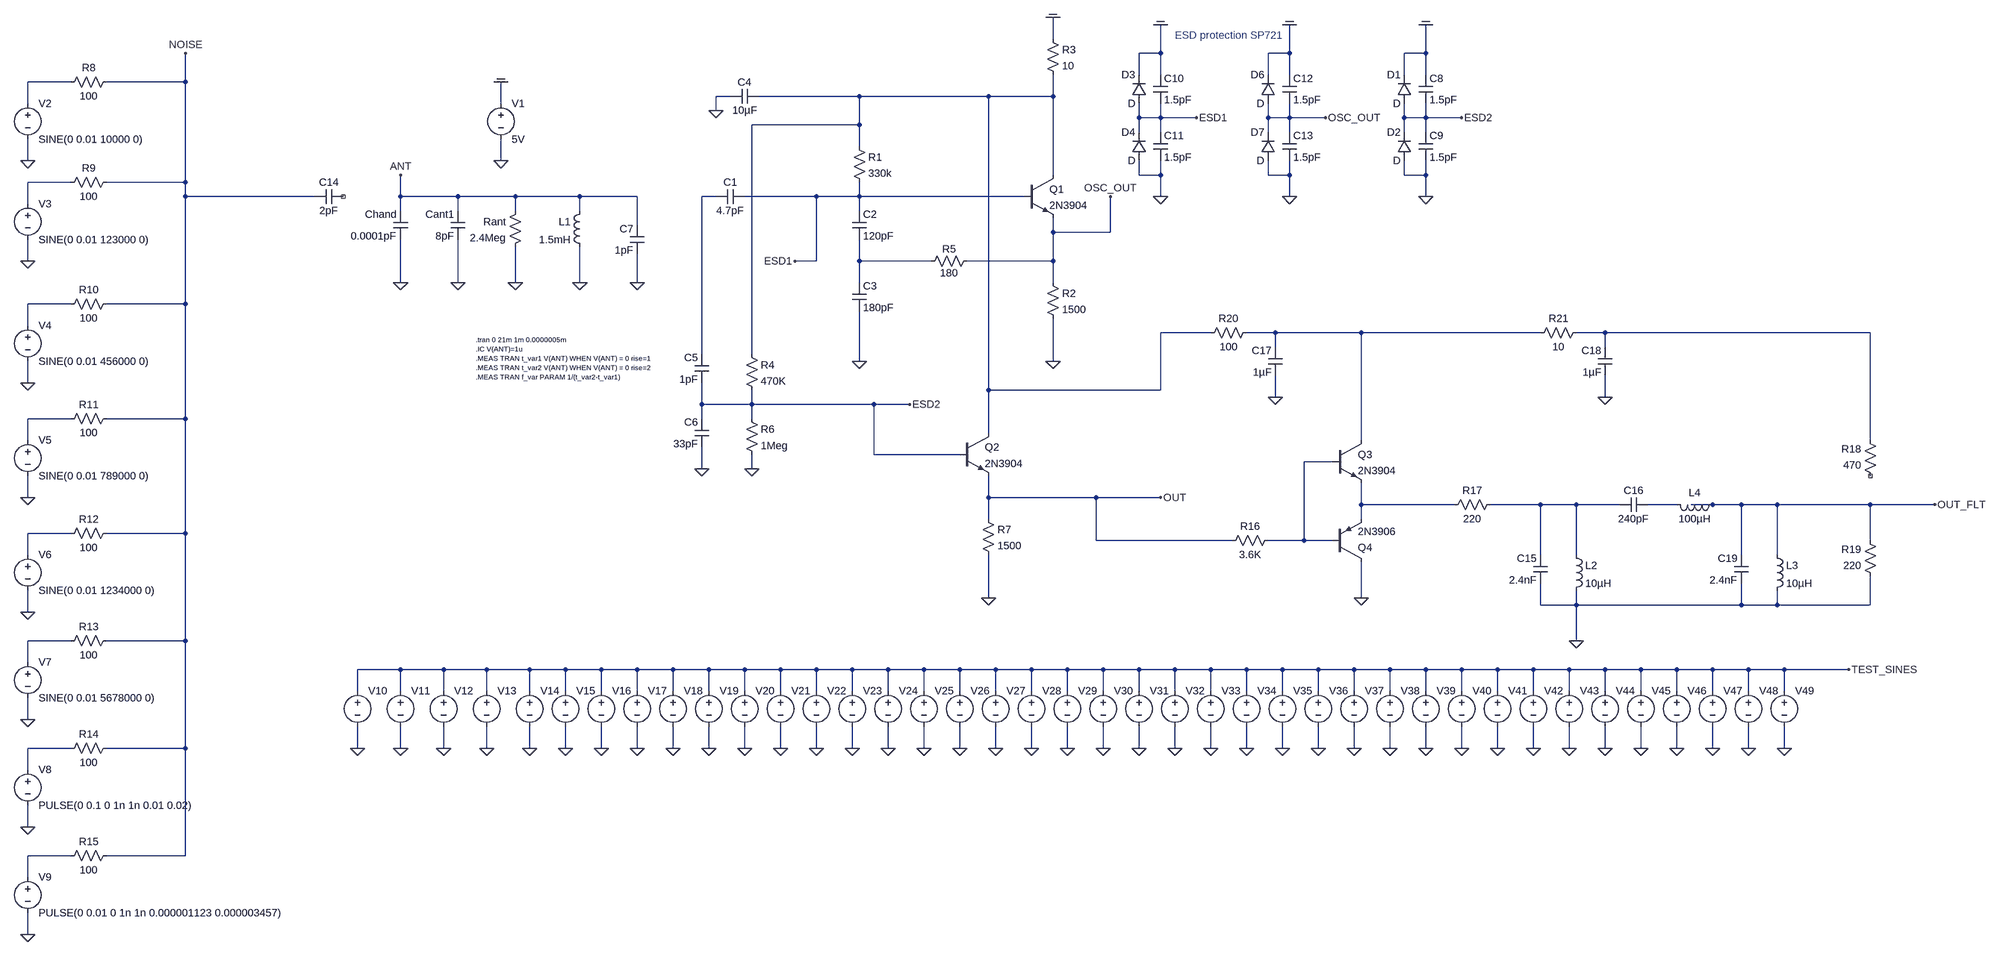
[diagram p0: schematic 2019_analog_oscill_sin_33v_noise_test_v02.asc]
2019_analog_oscill_sin_33v_noise_test_v02.asc, the LTspice schematic file:
Version 4
SHEET 1 2908 1860
WIRE 704 -160 704 -208
WIRE 944 -128 944 -192
WIRE 944 -128 896 -128
WIRE 1232 -128 1232 -192
WIRE 1232 -128 1184 -128
WIRE 1536 -128 1536 -192
WIRE 1536 -128 1488 -128
WIRE 896 -80 896 -128
WIRE 944 -80 944 -128
WIRE 1184 -80 1184 -128
WIRE 1232 -80 1232 -128
WIRE 1488 -80 1488 -128
WIRE 1536 -80 1536 -128
WIRE -1488 -64 -1584 -64
WIRE -1232 -64 -1232 -128
WIRE -1232 -64 -1408 -64
WIRE -16 -32 -48 -32
WIRE 272 -32 48 -32
WIRE 560 -32 272 -32
WIRE 704 -32 704 -80
WIRE 704 -32 560 -32
WIRE -1584 -16 -1584 -64
WIRE -528 -16 -528 -64
WIRE -48 0 -48 -32
WIRE 896 16 896 -16
WIRE 944 16 944 -16
WIRE 944 16 896 16
WIRE 1024 16 944 16
WIRE 1184 16 1184 -16
WIRE 1232 16 1232 -16
WIRE 1232 16 1184 16
WIRE 1312 16 1232 16
WIRE 1488 16 1488 -16
WIRE 1536 16 1536 -16
WIRE 1536 16 1488 16
WIRE 1616 16 1536 16
WIRE 272 32 272 -32
WIRE 272 32 32 32
WIRE 896 48 896 16
WIRE 944 48 944 16
WIRE 1184 48 1184 16
WIRE 1232 48 1232 16
WIRE 1488 48 1488 16
WIRE 1536 48 1536 16
WIRE 272 80 272 32
WIRE -1584 112 -1584 64
WIRE -528 112 -528 64
WIRE 704 144 704 -32
WIRE 896 144 896 112
WIRE 944 144 944 112
WIRE 944 144 896 144
WIRE 1184 144 1184 112
WIRE 1232 144 1232 112
WIRE 1232 144 1184 144
WIRE 1488 144 1488 112
WIRE 1536 144 1536 112
WIRE 1536 144 1488 144
WIRE -1488 160 -1584 160
WIRE -1232 160 -1232 -64
WIRE -1232 160 -1408 160
WIRE -1232 192 -1232 160
WIRE -944 192 -1232 192
WIRE -752 192 -752 144
WIRE -624 192 -752 192
WIRE -496 192 -624 192
WIRE -352 192 -496 192
WIRE -224 192 -352 192
WIRE -48 192 -80 192
WIRE 176 192 16 192
WIRE 272 192 272 160
WIRE 272 192 176 192
WIRE 640 192 272 192
WIRE 944 192 944 144
WIRE 1232 192 1232 144
WIRE 1536 192 1536 144
WIRE -1584 208 -1584 160
WIRE -752 224 -752 192
WIRE -624 224 -624 192
WIRE -496 224 -496 192
WIRE -352 224 -352 192
WIRE 272 224 272 192
WIRE -224 256 -224 192
WIRE 704 272 704 240
WIRE 832 272 832 192
WIRE 832 272 704 272
WIRE -1584 336 -1584 288
WIRE 176 336 176 192
WIRE 176 336 128 336
WIRE 272 336 272 288
WIRE 432 336 272 336
WIRE 704 336 704 272
WIRE 704 336 512 336
WIRE -752 384 -752 288
WIRE -624 384 -624 288
WIRE -496 384 -496 304
WIRE -352 384 -352 304
WIRE -224 384 -224 320
WIRE 272 384 272 336
WIRE 704 384 704 336
WIRE -1488 432 -1584 432
WIRE -1232 432 -1232 192
WIRE -1232 432 -1408 432
WIRE -1584 480 -1584 432
WIRE 1056 496 944 496
WIRE 1200 496 1136 496
WIRE 1392 496 1200 496
WIRE 1792 496 1392 496
WIRE 1936 496 1872 496
WIRE 2528 496 1936 496
WIRE 1200 528 1200 496
WIRE 1936 528 1936 496
WIRE -80 544 -80 192
WIRE 32 544 32 32
WIRE 272 560 272 448
WIRE 704 560 704 464
WIRE -1584 608 -1584 560
WIRE 560 624 560 -32
WIRE 944 624 944 496
WIRE 944 624 560 624
WIRE 1200 640 1200 592
WIRE 1936 640 1936 592
WIRE -80 656 -80 608
WIRE 32 656 32 624
WIRE 32 656 -80 656
WIRE 304 656 32 656
WIRE 384 656 304 656
WIRE -1488 688 -1584 688
WIRE -1232 688 -1232 432
WIRE -1232 688 -1408 688
WIRE -80 688 -80 656
WIRE 32 688 32 656
WIRE 560 720 560 624
WIRE -1584 736 -1584 688
WIRE 1392 736 1392 496
WIRE 2528 736 2528 496
WIRE 304 768 304 656
WIRE 496 768 304 768
WIRE 1328 784 1264 784
WIRE -80 800 -80 752
WIRE 32 800 32 768
WIRE -1584 864 -1584 816
WIRE 560 864 560 816
WIRE 800 864 560 864
WIRE 944 864 800 864
WIRE 1392 880 1392 832
WIRE 1600 880 1392 880
WIRE 1792 880 1680 880
WIRE 1872 880 1792 880
WIRE 1968 880 1872 880
WIRE 2096 880 2032 880
WIRE 2176 880 2128 880
WIRE 2240 880 2176 880
WIRE 2320 880 2240 880
WIRE 2528 880 2320 880
WIRE 2672 880 2528 880
WIRE 560 912 560 864
WIRE 1392 912 1392 880
WIRE -1488 944 -1584 944
WIRE -1232 944 -1232 688
WIRE -1232 944 -1408 944
WIRE 800 960 800 864
WIRE 1104 960 800 960
WIRE 1264 960 1264 784
WIRE 1264 960 1184 960
WIRE 1328 960 1264 960
WIRE 2528 960 2528 880
WIRE -1584 992 -1584 944
WIRE 1792 992 1792 880
WIRE 1872 992 1872 880
WIRE 2240 992 2240 880
WIRE 2320 992 2320 880
WIRE 560 1088 560 992
WIRE 1392 1088 1392 1008
WIRE 1792 1104 1792 1056
WIRE 1872 1104 1872 1072
WIRE 1872 1104 1792 1104
WIRE 2240 1104 2240 1056
WIRE 2240 1104 1872 1104
WIRE 2320 1104 2320 1072
WIRE 2320 1104 2240 1104
WIRE 2528 1104 2528 1040
WIRE 2528 1104 2320 1104
WIRE -1584 1120 -1584 1072
WIRE -1488 1184 -1584 1184
WIRE -1232 1184 -1232 944
WIRE -1232 1184 -1408 1184
WIRE 1872 1184 1872 1104
WIRE -1584 1232 -1584 1184
WIRE -752 1248 -848 1248
WIRE -656 1248 -752 1248
WIRE -560 1248 -656 1248
WIRE -464 1248 -560 1248
WIRE -384 1248 -464 1248
WIRE -304 1248 -384 1248
WIRE -224 1248 -304 1248
WIRE -144 1248 -224 1248
WIRE -64 1248 -144 1248
WIRE 16 1248 -64 1248
WIRE 96 1248 16 1248
WIRE 176 1248 96 1248
WIRE 256 1248 176 1248
WIRE 336 1248 256 1248
WIRE 416 1248 336 1248
WIRE 496 1248 416 1248
WIRE 576 1248 496 1248
WIRE 656 1248 576 1248
WIRE 736 1248 656 1248
WIRE 816 1248 736 1248
WIRE 896 1248 816 1248
WIRE 976 1248 896 1248
WIRE 1056 1248 976 1248
WIRE 1136 1248 1056 1248
WIRE 1216 1248 1136 1248
WIRE 1296 1248 1216 1248
WIRE 1376 1248 1296 1248
WIRE 1456 1248 1376 1248
WIRE 1536 1248 1456 1248
WIRE 1616 1248 1536 1248
WIRE 1696 1248 1616 1248
WIRE 1776 1248 1696 1248
WIRE 1856 1248 1776 1248
WIRE 1936 1248 1856 1248
WIRE 2016 1248 1936 1248
WIRE 2096 1248 2016 1248
WIRE 2176 1248 2096 1248
WIRE 2256 1248 2176 1248
WIRE 2336 1248 2256 1248
WIRE 2480 1248 2336 1248
WIRE -848 1296 -848 1248
WIRE -752 1296 -752 1248
WIRE -656 1296 -656 1248
WIRE -560 1296 -560 1248
WIRE -464 1296 -464 1248
WIRE -384 1296 -384 1248
WIRE -304 1296 -304 1248
WIRE -224 1296 -224 1248
WIRE -144 1296 -144 1248
WIRE -64 1296 -64 1248
WIRE 16 1296 16 1248
WIRE 96 1296 96 1248
WIRE 176 1296 176 1248
WIRE 256 1296 256 1248
WIRE 336 1296 336 1248
WIRE 416 1296 416 1248
WIRE 496 1296 496 1248
WIRE 576 1296 576 1248
WIRE 656 1296 656 1248
WIRE 736 1296 736 1248
WIRE 816 1296 816 1248
WIRE 896 1296 896 1248
WIRE 976 1296 976 1248
WIRE 1056 1296 1056 1248
WIRE 1136 1296 1136 1248
WIRE 1216 1296 1216 1248
WIRE 1296 1296 1296 1248
WIRE 1376 1296 1376 1248
WIRE 1456 1296 1456 1248
WIRE 1536 1296 1536 1248
WIRE 1616 1296 1616 1248
WIRE 1696 1296 1696 1248
WIRE 1776 1296 1776 1248
WIRE 1856 1296 1856 1248
WIRE 1936 1296 1936 1248
WIRE 2016 1296 2016 1248
WIRE 2096 1296 2096 1248
WIRE 2176 1296 2176 1248
WIRE 2256 1296 2256 1248
WIRE 2336 1296 2336 1248
WIRE -1584 1360 -1584 1312
WIRE -1488 1424 -1584 1424
WIRE -1232 1424 -1232 1184
WIRE -1232 1424 -1408 1424
WIRE -848 1424 -848 1376
WIRE -752 1424 -752 1376
WIRE -656 1424 -656 1376
WIRE -560 1424 -560 1376
WIRE -464 1424 -464 1376
WIRE -384 1424 -384 1376
WIRE -304 1424 -304 1376
WIRE -224 1424 -224 1376
WIRE -144 1424 -144 1376
WIRE -64 1424 -64 1376
WIRE 16 1424 16 1376
WIRE 96 1424 96 1376
WIRE 176 1424 176 1376
WIRE 256 1424 256 1376
WIRE 336 1424 336 1376
WIRE 416 1424 416 1376
WIRE 496 1424 496 1376
WIRE 576 1424 576 1376
WIRE 656 1424 656 1376
WIRE 736 1424 736 1376
WIRE 816 1424 816 1376
WIRE 896 1424 896 1376
WIRE 976 1424 976 1376
WIRE 1056 1424 1056 1376
WIRE 1136 1424 1136 1376
WIRE 1216 1424 1216 1376
WIRE 1296 1424 1296 1376
WIRE 1376 1424 1376 1376
WIRE 1456 1424 1456 1376
WIRE 1536 1424 1536 1376
WIRE 1616 1424 1616 1376
WIRE 1696 1424 1696 1376
WIRE 1776 1424 1776 1376
WIRE 1856 1424 1856 1376
WIRE 1936 1424 1936 1376
WIRE 2016 1424 2016 1376
WIRE 2096 1424 2096 1376
WIRE 2176 1424 2176 1376
WIRE 2256 1424 2256 1376
WIRE 2336 1424 2336 1376
WIRE -1584 1472 -1584 1424
WIRE -1584 1600 -1584 1552
WIRE -1488 1664 -1584 1664
WIRE -1232 1664 -1232 1424
WIRE -1232 1664 -1408 1664
WIRE -1584 1712 -1584 1664
WIRE -1584 1840 -1584 1792
FLAG -528 112 0
FLAG -752 384 0
FLAG -752 144 ANT
FLAG -352 384 0
FLAG 272 560 0
FLAG 704 560 0
FLAG -496 384 0
FLAG -48 0 0
FLAG 832 192 OSC_OUT
FLAG -528 -64 COM
FLAG 704 -208 COM
FLAG 944 192 0
FLAG 944 -192 COM
FLAG 1024 16 ESD1
FLAG 1232 192 0
FLAG 1232 -192 COM
FLAG 1312 16 OSC_OUT
FLAG 128 336 ESD1
FLAG 944 864 OUT
FLAG -80 800 0
FLAG 32 800 0
FLAG 560 1088 0
FLAG -224 384 0
FLAG 1536 192 0
FLAG 1536 -192 COM
FLAG 1616 16 ESD2
FLAG 384 656 ESD2
FLAG -1584 112 0
FLAG -1584 336 0
FLAG -1232 -128 NOISE
FLAG -1584 608 0
FLAG -1584 864 0
FLAG -1584 1120 0
FLAG -1584 1360 0
FLAG -1584 1600 0
FLAG -624 384 0
FLAG 1392 1088 0
FLAG 2672 880 OUT_FLT
FLAG 1872 1184 0
FLAG -1584 1840 0
FLAG 1200 640 0
FLAG 1936 640 0
FLAG -848 1424 0
FLAG -752 1424 0
FLAG -656 1424 0
FLAG -560 1424 0
FLAG -464 1424 0
FLAG -384 1424 0
FLAG -304 1424 0
FLAG -224 1424 0
FLAG -144 1424 0
FLAG -64 1424 0
FLAG 16 1424 0
FLAG 96 1424 0
FLAG 176 1424 0
FLAG 256 1424 0
FLAG 336 1424 0
FLAG 416 1424 0
FLAG 496 1424 0
FLAG 576 1424 0
FLAG 656 1424 0
FLAG 736 1424 0
FLAG 816 1424 0
FLAG 896 1424 0
FLAG 976 1424 0
FLAG 1056 1424 0
FLAG 1136 1424 0
FLAG 1216 1424 0
FLAG 1296 1424 0
FLAG 1376 1424 0
FLAG 1456 1424 0
FLAG 1536 1424 0
FLAG 1616 1424 0
FLAG 1696 1424 0
FLAG 1776 1424 0
FLAG 1856 1424 0
FLAG 1936 1424 0
FLAG 2016 1424 0
FLAG 2096 1424 0
FLAG 2176 1424 0
FLAG 2256 1424 0
FLAG 2336 1424 0
FLAG 2480 1248 TEST_SINES
SYMBOL cap 256 224 R0
SYMATTR InstName C2
SYMATTR Value 120pF
SYMBOL res 256 64 R0
SYMATTR InstName R1
SYMATTR Value 330k
SYMBOL voltage -528 -32 R0
WINDOW 123 0 0 Left 2
WINDOW 39 0 0 Left 2
SYMATTR InstName V1
SYMATTR Value 5V
SYMBOL ind -336 208 M0
SYMATTR InstName L1
SYMATTR Value 1.5mH
SYMATTR SpiceLine Ipk=0.1 Rser=120 Rpar=9Meg Cpar=1.76pF
SYMBOL cap -736 224 M0
SYMATTR InstName Chand
SYMATTR Value 0.0001pF
SYMBOL cap -48 176 M90
WINDOW 0 0 32 VBottom 2
WINDOW 3 32 32 VTop 2
SYMATTR InstName C1
SYMATTR Value 4.7pF
SYMBOL npn 640 144 R0
SYMATTR InstName Q1
SYMATTR Value 2N3904
SYMBOL cap 256 384 R0
SYMATTR InstName C3
SYMATTR Value 180pF
SYMBOL res 688 368 R0
SYMATTR InstName R2
SYMATTR Value 1500
SYMBOL res -480 208 M0
SYMATTR InstName Rant
SYMATTR Value 2.4Meg
SYMBOL cap 48 -48 R90
WINDOW 0 0 32 VBottom 2
WINDOW 3 32 32 VTop 2
SYMATTR InstName C4
SYMATTR Value 10µF
SYMBOL res 688 -176 R0
SYMATTR InstName R3
SYMATTR Value 10
SYMBOL res 528 320 R90
WINDOW 0 5 56 VBottom 2
WINDOW 3 27 56 VTop 2
SYMATTR InstName R5
SYMATTR Value 180
SYMBOL diode 912 -16 R180
WINDOW 0 24 64 Left 2
WINDOW 3 24 0 Left 2
SYMATTR InstName D3
SYMBOL diode 912 112 R180
WINDOW 0 24 64 Left 2
WINDOW 3 24 0 Left 2
SYMATTR InstName D4
SYMBOL cap 928 -80 R0
SYMATTR InstName C10
SYMATTR Value 1.5pF
SYMBOL cap 928 48 R0
SYMATTR InstName C11
SYMATTR Value 1.5pF
SYMBOL diode 1200 -16 R180
WINDOW 0 24 64 Left 2
WINDOW 3 24 0 Left 2
SYMATTR InstName D6
SYMBOL diode 1200 112 R180
WINDOW 0 24 64 Left 2
WINDOW 3 24 0 Left 2
SYMATTR InstName D7
SYMBOL cap 1216 -80 R0
SYMATTR InstName C12
SYMATTR Value 1.5pF
SYMBOL cap 1216 48 R0
SYMATTR InstName C13
SYMATTR Value 1.5pF
SYMBOL cap -64 544 M0
SYMATTR InstName C5
SYMATTR Value 1pF
SYMBOL cap -64 688 M0
SYMATTR InstName C6
SYMATTR Value 33pF
SYMBOL res 16 528 R0
SYMATTR InstName R4
SYMATTR Value 470K
SYMBOL res 16 672 R0
SYMATTR InstName R6
SYMATTR Value 1Meg
SYMBOL npn 496 720 R0
SYMATTR InstName Q2
SYMATTR Value 2N3904
SYMBOL res 544 896 R0
SYMATTR InstName R7
SYMATTR Value 1500
SYMBOL cap -208 256 M0
SYMATTR InstName C7
SYMATTR Value 1pF
SYMBOL diode 1504 -16 R180
WINDOW 0 24 64 Left 2
WINDOW 3 24 0 Left 2
SYMATTR InstName D1
SYMBOL diode 1504 112 R180
WINDOW 0 24 64 Left 2
WINDOW 3 24 0 Left 2
SYMATTR InstName D2
SYMBOL cap 1520 -80 R0
SYMATTR InstName C8
SYMATTR Value 1.5pF
SYMBOL cap 1520 48 R0
SYMATTR InstName C9
SYMATTR Value 1.5pF
SYMBOL voltage -1584 -32 R0
WINDOW 123 0 0 Left 0
WINDOW 39 0 0 Left 0
SYMATTR InstName V2
SYMATTR Value SINE(0 0.01 10000 0)
SYMBOL voltage -1584 192 R0
WINDOW 123 0 0 Left 0
WINDOW 39 0 0 Left 0
SYMATTR InstName V3
SYMATTR Value SINE(0 0.01 123000 0)
SYMBOL res -1392 -80 R90
WINDOW 0 0 56 VBottom 2
WINDOW 3 32 56 VTop 2
SYMATTR InstName R8
SYMATTR Value 100
SYMBOL res -1392 144 R90
WINDOW 0 0 56 VBottom 2
WINDOW 3 32 56 VTop 2
SYMATTR InstName R9
SYMATTR Value 100
SYMBOL cap -944 176 M90
WINDOW 0 0 32 VBottom 2
WINDOW 3 32 32 VTop 2
SYMATTR InstName C14
SYMATTR Value 2pF
SYMBOL voltage -1584 464 R0
WINDOW 123 0 0 Left 0
WINDOW 39 0 0 Left 0
SYMATTR InstName V4
SYMATTR Value SINE(0 0.01 456000 0)
SYMBOL res -1392 416 R90
WINDOW 0 0 56 VBottom 2
WINDOW 3 32 56 VTop 2
SYMATTR InstName R10
SYMATTR Value 100
SYMBOL voltage -1584 720 R0
WINDOW 123 0 0 Left 0
WINDOW 39 0 0 Left 0
SYMATTR InstName V5
SYMATTR Value SINE(0 0.01 789000 0)
SYMBOL res -1392 672 R90
WINDOW 0 0 56 VBottom 2
WINDOW 3 32 56 VTop 2
SYMATTR InstName R11
SYMATTR Value 100
SYMBOL voltage -1584 976 R0
WINDOW 123 0 0 Left 0
WINDOW 39 0 0 Left 0
SYMATTR InstName V6
SYMATTR Value SINE(0 0.01 1234000 0)
SYMBOL res -1392 928 R90
WINDOW 0 0 56 VBottom 2
WINDOW 3 32 56 VTop 2
SYMATTR InstName R12
SYMATTR Value 100
SYMBOL voltage -1584 1216 R0
WINDOW 123 0 0 Left 0
WINDOW 39 0 0 Left 0
SYMATTR InstName V7
SYMATTR Value SINE(0 0.01 5678000 0)
SYMBOL res -1392 1168 R90
WINDOW 0 0 56 VBottom 2
WINDOW 3 32 56 VTop 2
SYMATTR InstName R13
SYMATTR Value 100
SYMBOL voltage -1584 1456 R0
WINDOW 123 0 0 Left 0
WINDOW 39 0 0 Left 0
SYMATTR InstName V8
SYMATTR Value PULSE(0 0.1 0 1n 1n 0.01 0.02)
SYMBOL res -1392 1408 R90
WINDOW 0 0 56 VBottom 2
WINDOW 3 32 56 VTop 2
SYMATTR InstName R14
SYMATTR Value 100
SYMBOL cap -608 224 M0
SYMATTR InstName Cant1
SYMATTR Value 8pF
SYMBOL npn 1328 736 R0
SYMATTR InstName Q3
SYMATTR Value 2N3904
SYMBOL pnp 1328 1008 M180
SYMATTR InstName Q4
SYMATTR Value 2N3906
SYMBOL res 1200 944 R90
WINDOW 0 0 56 VBottom 2
WINDOW 3 32 56 VTop 2
SYMATTR InstName R16
SYMATTR Value 3.6K
SYMBOL cap 1808 992 M0
SYMATTR InstName C15
SYMATTR Value 2.4nF
SYMBOL cap 2032 896 M270
WINDOW 0 32 32 VTop 2
WINDOW 3 0 32 VBottom 2
SYMATTR InstName C16
SYMATTR Value 240pF
SYMBOL ind 1856 976 R0
SYMATTR InstName L2
SYMATTR Value 10µH
SYMATTR SpiceLine Rser=1
SYMBOL ind 2192 864 R90
WINDOW 0 5 56 VBottom 2
WINDOW 3 32 56 VTop 2
SYMATTR InstName L4
SYMATTR Value 100µH
SYMATTR SpiceLine Rser=10
SYMBOL res 1696 864 R90
WINDOW 0 0 56 VBottom 2
WINDOW 3 32 56 VTop 2
SYMATTR InstName R17
SYMATTR Value 220
SYMBOL res 2544 832 R180
WINDOW 0 36 76 Left 2
WINDOW 3 36 40 Left 2
SYMATTR InstName R18
SYMATTR Value 470
SYMBOL res 2544 1056 R180
WINDOW 0 36 76 Left 2
WINDOW 3 36 40 Left 2
SYMATTR InstName R19
SYMATTR Value 220
SYMBOL voltage -1584 1696 R0
WINDOW 123 0 0 Left 0
WINDOW 39 0 0 Left 0
SYMATTR InstName V9
SYMATTR Value PULSE(0 0.01 0 1n 1n 0.000001123 0.000003457)
SYMBOL res -1392 1648 R90
WINDOW 0 0 56 VBottom 2
WINDOW 3 32 56 VTop 2
SYMATTR InstName R15
SYMATTR Value 100
SYMBOL res 1152 480 R90
WINDOW 0 0 56 VBottom 2
WINDOW 3 32 56 VTop 2
SYMATTR InstName R20
SYMATTR Value 100
SYMBOL cap 1216 528 M0
SYMATTR InstName C17
SYMATTR Value 1µF
SYMBOL res 1888 480 R90
WINDOW 0 0 56 VBottom 2
WINDOW 3 32 56 VTop 2
SYMATTR InstName R21
SYMATTR Value 10
SYMBOL cap 1952 528 M0
SYMATTR InstName C18
SYMATTR Value 1µF
SYMBOL cap 2256 992 M0
SYMATTR InstName C19
SYMATTR Value 2.4nF
SYMBOL ind 2304 976 R0
SYMATTR InstName L3
SYMATTR Value 10µH
SYMATTR SpiceLine Rser=1
SYMBOL voltage -848 1280 R0
WINDOW 3 24 96 Invisible 2
WINDOW 123 0 0 Left 0
SYMATTR Value SINE(0 0.1 10000 0)
SYMATTR InstName V10
SYMATTR SpiceLine Rser=100
SYMBOL voltage -752 1280 R0
WINDOW 3 24 96 Invisible 2
WINDOW 123 0 0 Left 0
SYMATTR Value SINE(0 0.1 12725 0)
SYMATTR InstName V11
SYMATTR SpiceLine Rser=100
SYMBOL voltage -656 1280 R0
WINDOW 3 24 96 Invisible 2
WINDOW 123 0 0 Left 0
SYMATTR Value SINE(0 0.1 16192 0)
SYMATTR InstName V12
SYMATTR SpiceLine Rser=100
SYMBOL voltage -560 1280 R0
WINDOW 3 24 96 Invisible 2
WINDOW 123 0 0 Left 0
SYMATTR Value SINE(0 0.1 20604 0)
SYMATTR InstName V13
SYMATTR SpiceLine Rser=100
SYMBOL voltage -464 1280 R0
WINDOW 3 24 96 Invisible 2
WINDOW 123 0 0 Left 0
SYMATTR Value SINE(0 0.1 26218 0)
SYMATTR InstName V14
SYMATTR SpiceLine Rser=100
SYMBOL voltage -384 1280 R0
WINDOW 3 24 96 Invisible 2
WINDOW 123 0 0 Left 0
SYMATTR Value SINE(0 0.1 33362 0)
SYMATTR InstName V15
SYMATTR SpiceLine Rser=100
SYMBOL voltage -304 1280 R0
WINDOW 3 24 96 Invisible 2
WINDOW 123 0 0 Left 0
SYMATTR Value SINE(0 0.1 42453 0)
SYMATTR InstName V16
SYMATTR SpiceLine Rser=100
SYMBOL voltage -224 1280 R0
WINDOW 3 24 96 Invisible 2
WINDOW 123 0 0 Left 0
SYMATTR Value SINE(0 0.1 54020 0)
SYMATTR InstName V17
SYMATTR SpiceLine Rser=100
SYMBOL voltage -144 1280 R0
WINDOW 3 24 96 Invisible 2
WINDOW 123 0 0 Left 0
SYMATTR Value SINE(0 0.1 68740 0)
SYMATTR InstName V18
SYMATTR SpiceLine Rser=100
SYMBOL voltage -64 1280 R0
WINDOW 3 24 96 Invisible 2
WINDOW 123 0 0 Left 0
SYMATTR Value SINE(0 0.1 87470 0)
SYMATTR InstName V19
SYMATTR SpiceLine Rser=100
SYMBOL voltage 16 1280 R0
WINDOW 3 24 96 Invisible 2
WINDOW 123 0 0 Left 0
SYMATTR Value SINE(0 0.1 111303 0)
SYMATTR InstName V20
SYMATTR SpiceLine Rser=100
SYMBOL voltage 96 1280 R0
WINDOW 3 24 96 Invisible 2
WINDOW 123 0 0 Left 0
SYMATTR Value SINE(0 0.1 141631 0)
SYMATTR InstName V21
SYMATTR SpiceLine Rser=100
SYMBOL voltage 176 1280 R0
WINDOW 3 24 96 Invisible 2
WINDOW 123 0 0 Left 0
SYMATTR Value SINE(0 0.1 180223 0)
SYMATTR InstName V22
SYMATTR SpiceLine Rser=100
SYMBOL voltage 256 1280 R0
WINDOW 3 24 96 Invisible 2
WINDOW 123 0 0 Left 0
SYMATTR Value SINE(0 0.1 229330 0)
SYMATTR InstName V23
SYMATTR SpiceLine Rser=100
SYMBOL voltage 336 1280 R0
WINDOW 3 24 96 Invisible 2
WINDOW 123 0 0 Left 0
SYMATTR Value SINE(0 0.1 291818 0)
SYMATTR InstName V24
SYMATTR SpiceLine Rser=100
SYMBOL voltage 416 1280 R0
WINDOW 3 24 96 Invisible 2
WINDOW 123 0 0 Left 0
SYMATTR Value SINE(0 0.1 371332 0)
SYMATTR InstName V25
SYMATTR SpiceLine Rser=100
SYMBOL voltage 496 1280 R0
WINDOW 3 24 96 Invisible 2
WINDOW 123 0 0 Left 0
SYMATTR Value SINE(0 0.1 472512 0)
SYMATTR InstName V26
SYMATTR SpiceLine Rser=100
SYMBOL voltage 576 1280 R0
WINDOW 3 24 96 Invisible 2
WINDOW 123 0 0 Left 0
SYMATTR Value SINE(0 0.1 601262 0)
SYMATTR InstName V27
SYMATTR SpiceLine Rser=100
SYMBOL voltage 656 1280 R0
WINDOW 3 24 96 Invisible 2
WINDOW 123 0 0 Left 0
SYMATTR Value SINE(0 0.1 765094 0)
SYMATTR InstName V28
SYMATTR SpiceLine Rser=100
SYMBOL voltage 736 1280 R0
WINDOW 3 24 96 Invisible 2
WINDOW 123 0 0 Left 0
SYMATTR Value SINE(0 0.1 973566 0)
SYMATTR InstName V29
SYMATTR SpiceLine Rser=100
SYMBOL voltage 816 1280 R0
WINDOW 3 24 96 Invisible 2
WINDOW 123 0 0 Left 0
SYMATTR Value SINE(0 0.1 1238843 0)
SYMATTR InstName V30
SYMATTR SpiceLine Rser=100
SYMBOL voltage 896 1280 R0
WINDOW 3 24 96 Invisible 2
WINDOW 123 0 0 Left 0
SYMATTR Value SINE(0 0.1 1576403 0)
SYMATTR InstName V31
SYMATTR SpiceLine Rser=100
SYMBOL voltage 976 1280 R0
WINDOW 3 24 96 Invisible 2
WINDOW 123 0 0 Left 0
SYMATTR Value SINE(0 0.1 2005940 0)
SYMATTR InstName V32
SYMATTR SpiceLine Rser=100
SYMBOL voltage 1056 1280 R0
WINDOW 3 24 96 Invisible 2
WINDOW 123 0 0 Left 0
SYMATTR Value SINE(0 0.1 2552518 0)
SYMATTR InstName V33
SYMATTR SpiceLine Rser=100
SYMBOL voltage 1136 1280 R0
WINDOW 3 24 96 Invisible 2
WINDOW 123 0 0 Left 0
SYMATTR Value SINE(0 0.1 3248027 0)
SYMATTR InstName V34
SYMATTR SpiceLine Rser=100
SYMBOL voltage 1216 1280 R0
WINDOW 3 24 96 Invisible 2
WINDOW 123 0 0 Left 0
SYMATTR Value SINE(0 0.1 4133048 0)
SYMATTR InstName V35
SYMATTR SpiceLine Rser=100
SYMBOL voltage 1296 1280 R0
WINDOW 3 24 96 Invisible 2
WINDOW 123 0 0 Left 0
SYMATTR Value SINE(0 0.1 5259219 0)
SYMATTR InstName V36
SYMATTR SpiceLine Rser=100
SYMBOL voltage 1376 1280 R0
WINDOW 3 24 96 Invisible 2
WINDOW 123 0 0 Left 0
SYMATTR Value SINE(0 0.1 6692248 0)
SYMATTR InstName V37
SYMATTR SpiceLine Rser=100
SYMBOL voltage 1456 1280 R0
WINDOW 3 24 96 Invisible 2
WINDOW 123 0 0 Left 0
SYMATTR Value SINE(0 0.1 8515749 0)
SYMATTR InstName V38
SYMATTR SpiceLine Rser=100
SYMBOL voltage 1536 1280 R0
WINDOW 3 24 96 Invisible 2
WINDOW 123 0 0 Left 0
SYMATTR Value SINE(0 0.1 10836117 0)
SYMATTR InstName V39
SYMATTR SpiceLine Rser=100
SYMBOL voltage 1616 1280 R0
WINDOW 3 24 96 Invisible 2
WINDOW 123 0 0 Left 0
SYMATTR Value SINE(0 0.1 13788737 0)
SYMATTR InstName V40
SYMATTR SpiceLine Rser=100
SYMBOL voltage 1696 1280 R0
WINDOW 3 24 96 Invisible 2
WINDOW 123 0 0 Left 0
SYMATTR Value SINE(0 0.1 17545886 0)
SYMATTR InstName V41
SYMATTR SpiceLine Rser=100
SYMBOL voltage 1776 1280 R0
WINDOW 3 24 96 Invisible 2
WINDOW 123 0 0 Left 0
SYMATTR Value SINE(0 0.1 22326781 0)
SYMATTR InstName V42
SYMATTR SpiceLine Rser=100
SYMBOL voltage 1856 1280 R0
WINDOW 3 24 96 Invisible 2
WINDOW 123 0 0 Left 0
SYMATTR Value SINE(0 0.1 28410373 0)
SYMATTR InstName V43
SYMATTR SpiceLine Rser=100
SYMBOL voltage 1936 1280 R0
WINDOW 3 24 96 Invisible 2
WINDOW 123 0 0 Left 0
SYMATTR Value SINE(0 0.1 36151619 0)
SYMATTR InstName V44
SYMATTR SpiceLine Rser=100
SYMBOL voltage 2016 1280 R0
WINDOW 3 24 96 Invisible 2
WINDOW 123 0 0 Left 0
SYMATTR Value SINE(0 0.1 46002197 0)
SYMATTR InstName V45
SYMATTR SpiceLine Rser=100
SYMBOL voltage 2096 1280 R0
WINDOW 3 24 96 Invisible 2
WINDOW 123 0 0 Left 0
SYMATTR Value SINE(0 0.1 58536855 0)
SYMATTR InstName V46
SYMATTR SpiceLine Rser=100
SYMBOL voltage 2176 1280 R0
WINDOW 3 24 96 Invisible 2
WINDOW 123 0 0 Left 0
SYMATTR Value SINE(0 0.1 74486952 0)
SYMATTR InstName V47
SYMATTR SpiceLine Rser=100
SYMBOL voltage 2256 1280 R0
WINDOW 3 24 96 Invisible 2
WINDOW 123 0 0 Left 0
SYMATTR Value SINE(0 0.1 94783124 0)
SYMATTR InstName V48
SYMATTR SpiceLine Rser=100
SYMBOL voltage 2336 1280 R0
WINDOW 3 24 96 Invisible 2
WINDOW 123 0 0 Left 0
SYMATTR Value SINE(0 0.1 120609589 0)
SYMATTR InstName V49
SYMATTR SpiceLine Rser=100
TEXT -584 512 Left 1 !.tran 0 21m 1m 0.0000005m\n.IC V(ANT)=1u\n.MEAS TRAN t_var1 V(ANT) WHEN V(ANT) = 0 rise=1\n.MEAS TRAN t_var2 V(ANT) WHEN V(ANT) = 0 rise=2\n.MEAS TRAN f_var PARAM 1/(t_var2-t_var1)
TEXT 976 -168 Left 2 ;ESD protection SP721

The netlist it stands for:
* 2019_analog_oscill_sin_33v_noise_test_v02.asc
C2 ESD1 N005 120pF
R1 N002 ESD1 330k
V1 COM 0 5V
L1 ANT 0 1.5mH Ipk=0.1 Rser=120 Rpar=9Meg Cpar=1.76pF
Chand ANT 0 0.0001pF
C1 N004 ESD1 4.7pF
Q1 N002 ESD1 OSC_OUT 0 2N3904
C3 N005 0 180pF
R2 OSC_OUT 0 1500
Rant ANT 0 2.4Meg
C4 N002 0 10µF
R3 COM N002 10
R5 OSC_OUT N005 180
D3 ESD1 COM D
D4 0 ESD1 D
C10 COM ESD1 1.5pF
C11 ESD1 0 1.5pF
D6 OSC_OUT COM D
D7 0 OSC_OUT D
C12 COM OSC_OUT 1.5pF
C13 OSC_OUT 0 1.5pF
C5 N004 ESD2 1pF
C6 ESD2 0 33pF
R4 N002 ESD2 470K
R6 ESD2 0 1Meg
Q2 N002 ESD2 OUT 0 2N3904
R7 OUT 0 1500
C7 ANT 0 1pF
D1 ESD2 COM D
D2 0 ESD2 D
C8 COM ESD2 1.5pF
C9 ESD2 0 1.5pF
V2 N001 0 SINE(0 0.01 10000 0)
V3 N003 0 SINE(0 0.01 123000 0)
R8 NOISE N001 100
R9 NOISE N003 100
C14 NOISE NC_01 2pF
V4 N006 0 SINE(0 0.01 456000 0)
R10 NOISE N006 100
V5 N009 0 SINE(0 0.01 789000 0)
R11 NOISE N009 100
V6 N014 0 SINE(0 0.01 1234000 0)
R12 NOISE N014 100
V7 N015 0 SINE(0 0.01 5678000 0)
R13 NOISE N015 100
V8 N016 0 PULSE(0 0.1 0 1n 1n 0.01 0.02)
R14 NOISE N016 100
Cant1 ANT 0 8pF
Q3 N007 N010 N011 0 2N3904
Q4 0 N010 N011 0 2N3906
R16 N010 OUT 3.6K
C15 N012 0 2.4nF
C16 N013 N012 240pF
L2 N012 0 10µH Rser=1
L4 OUT_FLT N013 100µH Rser=10
R17 N012 N011 220
R18 NC_02 N008 470
R19 0 OUT_FLT 220
V9 N017 0 PULSE(0 0.01 0 1n 1n 0.000001123 0.000003457)
R15 NOISE N017 100
R20 N007 N002 100
C17 N007 0 1µF
R21 N008 N007 10
C18 N008 0 1µF
C19 OUT_FLT 0 2.4nF
L3 OUT_FLT 0 10µH Rser=1
V10 TEST_SINES 0 SINE(0 0.1 10000 0) Rser=100
V11 TEST_SINES 0 SINE(0 0.1 12725 0) Rser=100
V12 TEST_SINES 0 SINE(0 0.1 16192 0) Rser=100
V13 TEST_SINES 0 SINE(0 0.1 20604 0) Rser=100
V14 TEST_SINES 0 SINE(0 0.1 26218 0) Rser=100
V15 TEST_SINES 0 SINE(0 0.1 33362 0) Rser=100
V16 TEST_SINES 0 SINE(0 0.1 42453 0) Rser=100
V17 TEST_SINES 0 SINE(0 0.1 54020 0) Rser=100
V18 TEST_SINES 0 SINE(0 0.1 68740 0) Rser=100
V19 TEST_SINES 0 SINE(0 0.1 87470 0) Rser=100
V20 TEST_SINES 0 SINE(0 0.1 111303 0) Rser=100
V21 TEST_SINES 0 SINE(0 0.1 141631 0) Rser=100
V22 TEST_SINES 0 SINE(0 0.1 180223 0) Rser=100
V23 TEST_SINES 0 SINE(0 0.1 229330 0) Rser=100
V24 TEST_SINES 0 SINE(0 0.1 291818 0) Rser=100
V25 TEST_SINES 0 SINE(0 0.1 371332 0) Rser=100
V26 TEST_SINES 0 SINE(0 0.1 472512 0) Rser=100
V27 TEST_SINES 0 SINE(0 0.1 601262 0) Rser=100
V28 TEST_SINES 0 SINE(0 0.1 765094 0) Rser=100
V29 TEST_SINES 0 SINE(0 0.1 973566 0) Rser=100
V30 TEST_SINES 0 SINE(0 0.1 1238843 0) Rser=100
V31 TEST_SINES 0 SINE(0 0.1 1576403 0) Rser=100
V32 TEST_SINES 0 SINE(0 0.1 2005940 0) Rser=100
V33 TEST_SINES 0 SINE(0 0.1 2552518 0) Rser=100
V34 TEST_SINES 0 SINE(0 0.1 3248027 0) Rser=100
V35 TEST_SINES 0 SINE(0 0.1 4133048 0) Rser=100
V36 TEST_SINES 0 SINE(0 0.1 5259219 0) Rser=100
V37 TEST_SINES 0 SINE(0 0.1 6692248 0) Rser=100
V38 TEST_SINES 0 SINE(0 0.1 8515749 0) Rser=100
V39 TEST_SINES 0 SINE(0 0.1 10836117 0) Rser=100
V40 TEST_SINES 0 SINE(0 0.1 13788737 0) Rser=100
V41 TEST_SINES 0 SINE(0 0.1 17545886 0) Rser=100
V42 TEST_SINES 0 SINE(0 0.1 22326781 0) Rser=100
V43 TEST_SINES 0 SINE(0 0.1 28410373 0) Rser=100
V44 TEST_SINES 0 SINE(0 0.1 36151619 0) Rser=100
V45 TEST_SINES 0 SINE(0 0.1 46002197 0) Rser=100
V46 TEST_SINES 0 SINE(0 0.1 58536855 0) Rser=100
V47 TEST_SINES 0 SINE(0 0.1 74486952 0) Rser=100
V48 TEST_SINES 0 SINE(0 0.1 94783124 0) Rser=100
V49 TEST_SINES 0 SINE(0 0.1 120609589 0) Rser=100
.model D D
.lib standard.dio
.model NPN NPN
.model PNP PNP
.lib standard.bjt
.tran 0 21m 1m 0.0000005m
.IC V(ANT)=1u
.MEAS TRAN t_var1 V(ANT) WHEN V(ANT) = 0 rise=1
.MEAS TRAN t_var2 V(ANT) WHEN V(ANT) = 0 rise=2
.MEAS TRAN f_var PARAM 1/(t_var2-t_var1)
* ESD protection SP721
.backanno
.end